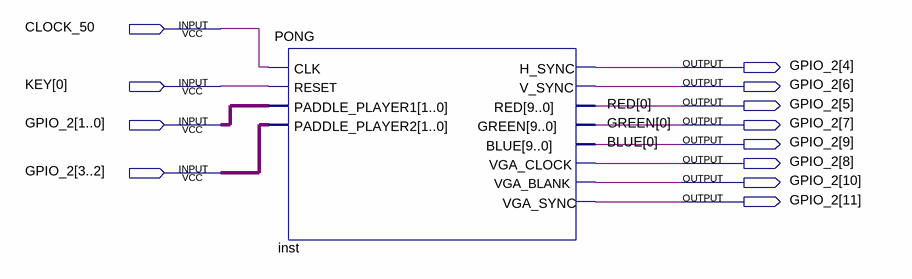
[diagram p0: schematic sheet]
// Quartus schematic DE0_nano.bdf as structural Verilog: 1 symbols, 12 pins
module DE0_nano (
  input  CLOCK_50,
  input  [0:0] KEY,
  inout  [11:0] GPIO_2
);

  PONG inst (
    .CLK(CLOCK_50), .RESET(KEY[0]), .PADDLE_PLAYER1(GPIO_2[1:0]), .PADDLE_PLAYER2(GPIO_2[3:2]),
    .H_SYNC(GPIO_2[4]), .V_SYNC(GPIO_2[6]), .RED(GPIO_2[5]), .GREEN(GPIO_2[7]), .BLUE(GPIO_2[9]),
    .VGA_CLOCK(GPIO_2[8]), .VGA_BLANK(GPIO_2[10]), .VGA_SYNC(GPIO_2[11]));

  // Other names for the same wires on the sheet: BLUE[0] = GPIO_2[9]; GREEN[0] = GPIO_2[7]; RED[0] = GPIO_2[5]
endmodule
